# EAGLE design sensor4 (EAGLE 6.5.0)
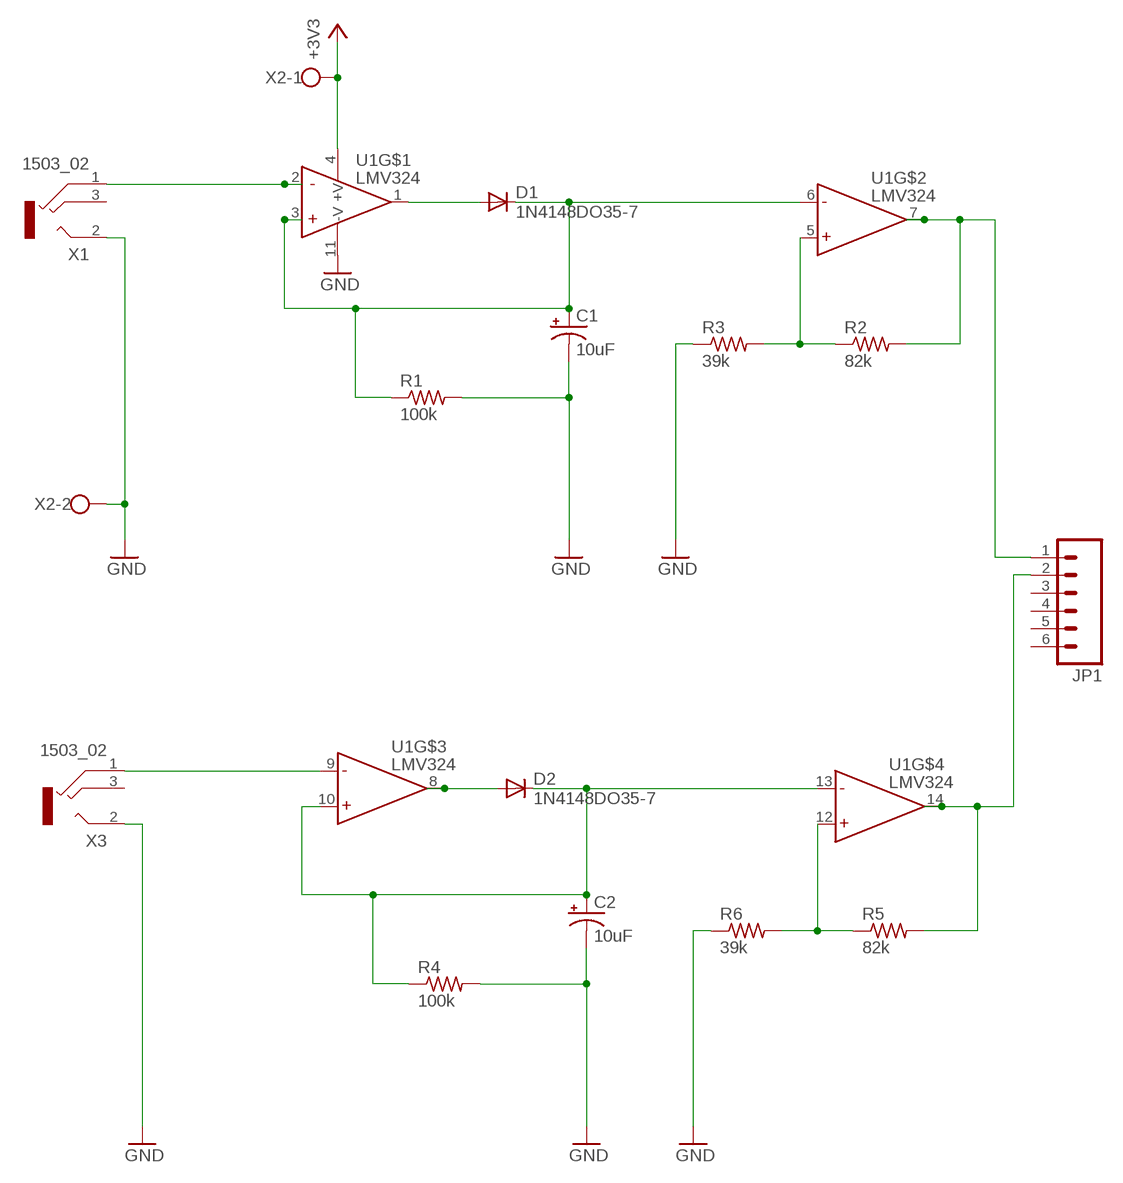
[diagram p0: schematic, sheet 1]

## Parts
C1  10uF  CPOL-USE2.5-5  [E2,5-5]
C2  10uF  CPOL-USE2.5-5  [E2,5-5]
D1  1N4148DO35-7  [DO35-7]
D2  1N4148DO35-7  [DO35-7]
JP1  M06SIP  [1X06]
R1  100k  R-US_0207/10  [0207/10]
R2  82k  R-US_0207/10  [0207/10]
R3  39k  R-US_0207/10  [0207/10]
R4  100k  R-US_0207/10  [0207/10]
R5  82k  R-US_0207/10  [0207/10]
R6  39k  R-US_0207/10  [0207/10]
U1  LMV324  [SO014]
X1  1503_02  [1503_02]
X2  W237-102  [W237-102]
X3  1503_02  [1503_02]

## Nets
+3V3: U1.4(+V) X2.1
GND: C1.- C2.- R1.2 R3.1 R4.2 R6.1 U1.11(-V) X1.2 X2.2 X3.2
N$1: D1.A U1.1(OUT)
N$2: C1.+ D1.C R1.1 U1.3(+IN) U1.6(-IN)
N$3: D2.A U1.8(OUT)
N$4: C2.+ D2.C R4.1 U1.10(+IN) U1.13(-IN)
N$5: R2.1 R3.2 U1.5(+IN)
N$6: U1.2(-IN) X1.1
N$7: JP1.1 R2.2 U1.7(OUT)
N$8: R5.1 R6.2 U1.12(+IN)
N$9: U1.9(-IN) X3.1
N$10: JP1.2 R5.2 U1.14(OUT)
Unconnected: JP1.3 JP1.4 JP1.5 JP1.6 X1.2@2 X1.3 X3.2@2 X3.3

## Library data of the parts
C1 C2 = resistor:CPOL-US: POLARIZED CAPACITOR, American symbol
D1 D2 = diode:1N4148: DIODE high speed (Philips)
JP1 = SparkFun-Connectors:M06: Header 6 Standard 6-pin 0.1" header. Use with straight break away headers (SKU : PRT-00116), right angle break away headers (PRT-00553), swiss pins (PRT-00743), machine pins (PRT-00117), and female headers (PRT-00115). Molex polarized connector foot print use with SKU : PRT-08094 with associated crimp pins and housings. NOTES ON THE VARIANTS LOCK and LOCK_LONGPADS... This footprint was designed to help hold the alignment of a through-hole component (i.e. 6-pin header) while soldering it into place. You may notice that each hole has been shifted either up or down by 0.005 of an inch from it's more standard position (which is a perfectly straight line). This slight alteration caused the pins (the squares in the middle) to touch the edges of the holes. Because they are alternating, it causes a "brace" to hold the component in place. 0.005 has proven to be the perfect amount of "off-center" position when using our standard breakaway headers. Although looks a little odd when you look at the bare footprint, once you have a header in there, the alteration is very hard to notice. Also,if you push a header all the way into place, it is covered up entirely on the bottom side. This idea of altering the position of holes to aid alignment will be further integrated into the Sparkfun Library for other footprints. It can help hold any component with 3 or more connection pins.
R1-R6 = resistor:R-US_: RESISTOR, American symbol
U1 = SparkFun-AnalogIC:LMV324: Jellybean quad op-amp; PROD_ID: IC-08227
X1 X3 = con-lumberg:1503_02: Jack connectors according to JISC 6560, 3.5 mm Klinkeneinbaukupplung nach JISC 6560, 3,5 mm, 3-polig/stereo, abgewinkelte Ausführung, Surface-Mount-Technik (SMT) Source: http://www.lumberg.com/Produkte/PDFs/1503_02.pdf; OC_FARNELL: 1216979; OC_NEWARK: unknown
X2 = con-wago-500:W237-102: WAGO SCREW CLAMP; MPN: 237-102; OC_FARNELL: unknown; OC_NEWARK: 70K9898

## Board
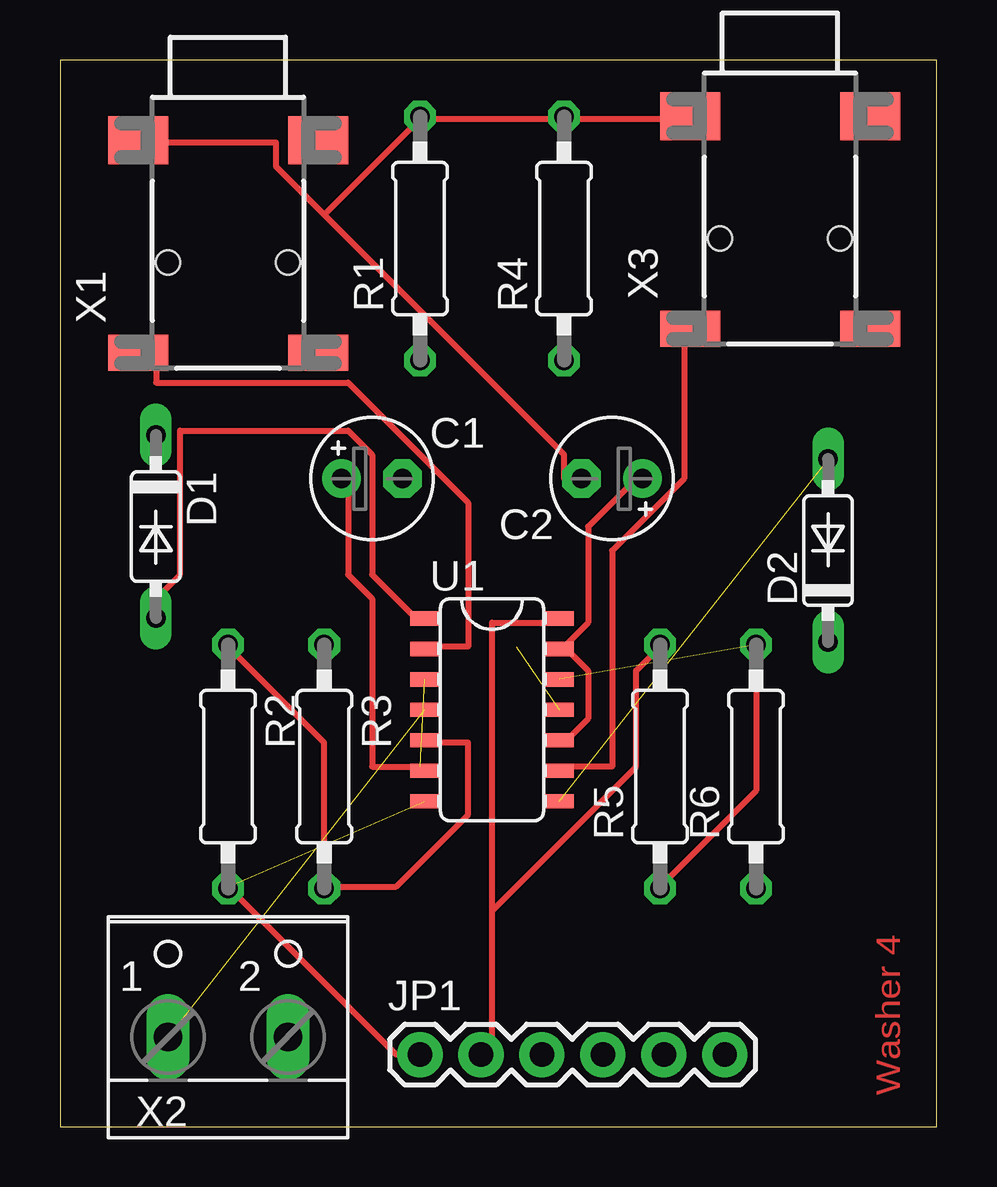
[diagram p1: board, top side]
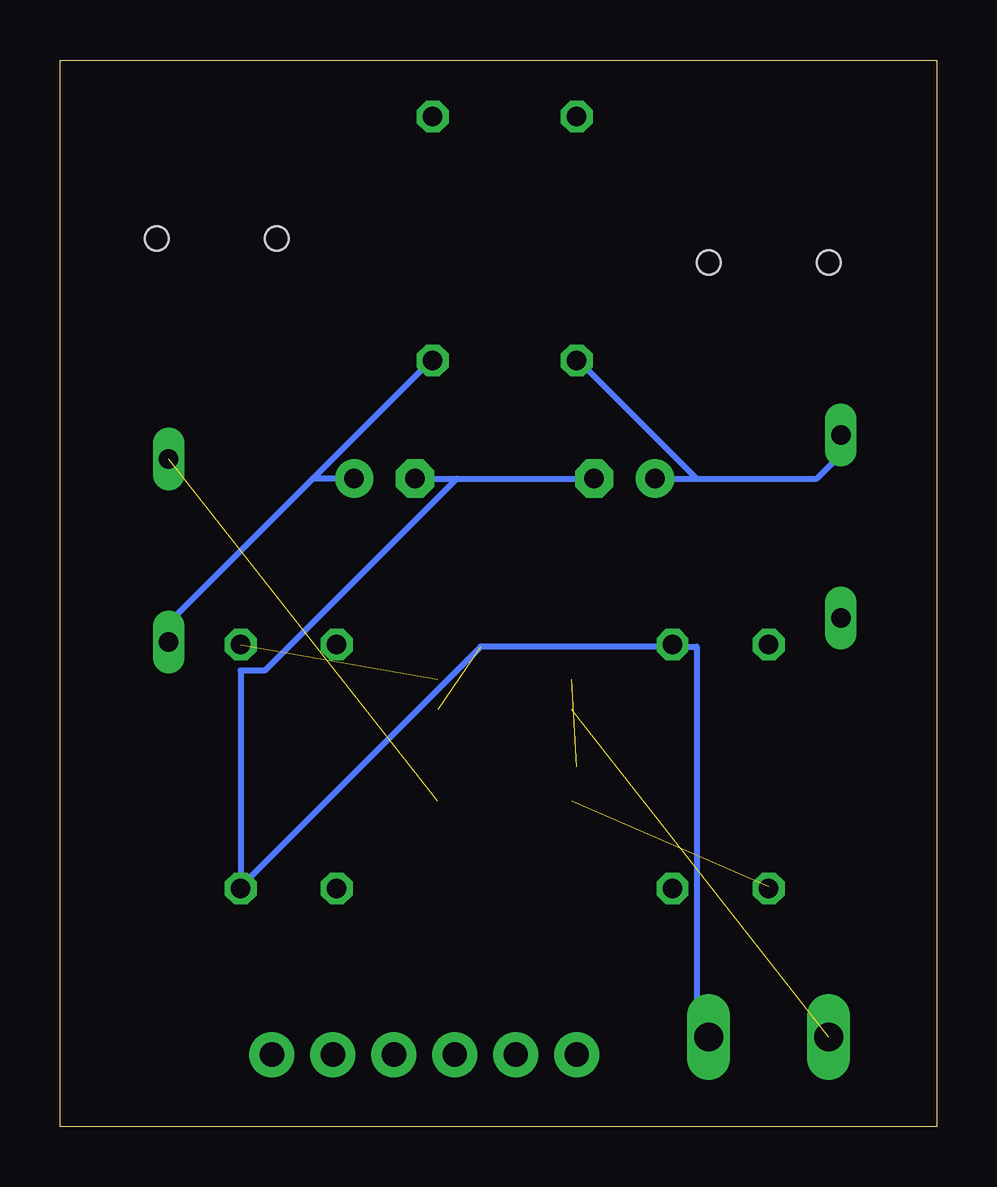
[diagram p2: board, bottom side, seen from below]

Size 36.53 x 44.44 mm. Coordinates in mm from the lower left corner, seen from the top.
Outline: 0,0 36.53,0 36.53,44.44 0,44.44 0,0
Copper layers (1*16): Top 0.035mm / dielectric 1.5mm / Bottom 0.035mm
Design rules "default *": minimum track width 10mil, minimum drill 24mil, track to track 8mil, track to pad 8mil, pad to pad 8mil, via to via 8mil, smd to smd 8mil, copper to edge 40mil, drill to drill 8mil, minimum pad ring 10mil, minimum via ring 8mil, stop-mask expansion 4mil, vias tented up to drill 0mil, thermal gap 10mil

### Footprints (pad centres in the part's own frame; a part is rotated, then mirrored left to right if it is on the bottom)
E2,5-5 = drill 0.813 pad 1.6: + -1.27,0 | drill 0.813 pad 1.6 octagon: - 1.27,0
DO35-7 = drill 0.813 long: A 3.81,0; C -3.81,0
1X06 = drill 1.016 pad 1.88: 1 0,0; 2 2.54,0; 3 5.08,0; 4 7.62,0; 5 10.16,0; 6 12.7,0
0207/10 = drill 0.813 octagon: 1 -5.08,0; 2 5.08,0
SO014 = smd 0.6 x 1.2: 1 -3.175,-2.8; 2 -1.905,-2.8; 3 -0.635,-2.8; 4 0.635,-2.8; 5 1.905,-2.8; 6 3.175,-2.8; 7 4.445,-2.8; 8 4.445,2.8; 9 3.175,2.8; 10 1.905,2.8; 11 0.635,2.8; 12 -0.635,2.8; 13 -1.905,2.8; 14 -3.175,2.8
1503_02 = smd 2.5 x 1.5: 1 -3.75,-10.75; 3 3.75,-10.75 | smd 2.5 x 2: 2 -3.75,-1.9; 2@2 3.75,-1.9 | hole 1: -2.5,-7; 2.5,-7
W237-102 = drill 1.194 long: 1 -2.5,-1.27; 2 2.5,-1.27

### Placement (x,y rotation side)
C1  13,27 0 top
C2  23,27 180 top
D1  3.99,25 270 top
D2  32,24 90 top
JP1  15,3 0 top
R1  15,37 90 top
R2  7,15 270 top
R3  11.01,15 270 top
R4  21,37 90 top
R5  25,15 90 top
R6  29,15 90 top
U1  18,18 270 top
X1  7,42.99 0 top
X2  7,5 0 top
X3  30,44 0 top

### Tracks (layer width: path | path; a pad name or v marks a point on that pad's centre or on a via)
+3V3  (1 unrouted)
GND  (1 unrouted)
  Top 0.254: 21,42 26,42 X3.2 | 11,38 21,28 21,27 C2.- | 11,38 9,40 9,41 4,41 X1.2 | 11,38 15,42 | 15,42 21,42 | 21,42 R4.2 | 15,42 R1.2
  Bottom 0.254: 29,10 19,20 11,20 | 11,20 10,20 10,4 X2.2 | 11,20 R3.1 | C2.- 20,27 | 20,27 C1.- | 29,10 29,19 28,19 20,27 | 29,10 R6.1
N$1
  Top 0.254: U1.1 15,21 13,23 13,28 12,29 5,29 5,23 4,22 D1.A
N$2  (1 unrouted)
  Top 0.254: U1.6 15,15 13,15 13,22 12,23 12,27 C1.+
  Bottom 0.254: C1.+ 10,27 | 10,27 5,27 4,28 D1.C | 10,27 15,32 R1.1
N$3  (1 unrouted)
N$4
  Top 0.254: 21,20 22,19 22,17 21,16 U1.10 | 21,20 22,21 22,25 24,27 C2.+ | 21,20 U1.13
  Bottom 0.254: 26,27 32,21 D2.C | C2.+ 26,27 | 26,27 21,32 R4.1
N$5
  Top 0.254: 11,10 14,10 17,13 17,16 15,16 U1.5 | 11,10 11,16 7,20 R2.1 | 11,10 R3.2
N$6
  Top 0.254: U1.2 15,20 17,20 17,26 12,31 4,31 4,32 X1.1
N$7  (1 unrouted)
  Top 0.254: JP1.1 14,3 7,10 R2.2
N$8  (1 unrouted)
  Top 0.254: R6.2 29,14 25,10 R5.1
N$9
  Top 0.254: U1.9 21,15 23,15 23,24 26,27 26,33 X3.1
N$10
  Top 0.254: 18,9 18,3 JP1.2 | 18,9 18,21 21,21 U1.14 | 18,9 24,15 24,19 25,20 R5.2

### Text on the board
Top: Washer 4